# Altium schematic sheet ConectoresEntrada.SchDoc
size 355 x 254 mm; DrawnBy: Constanza Barriga
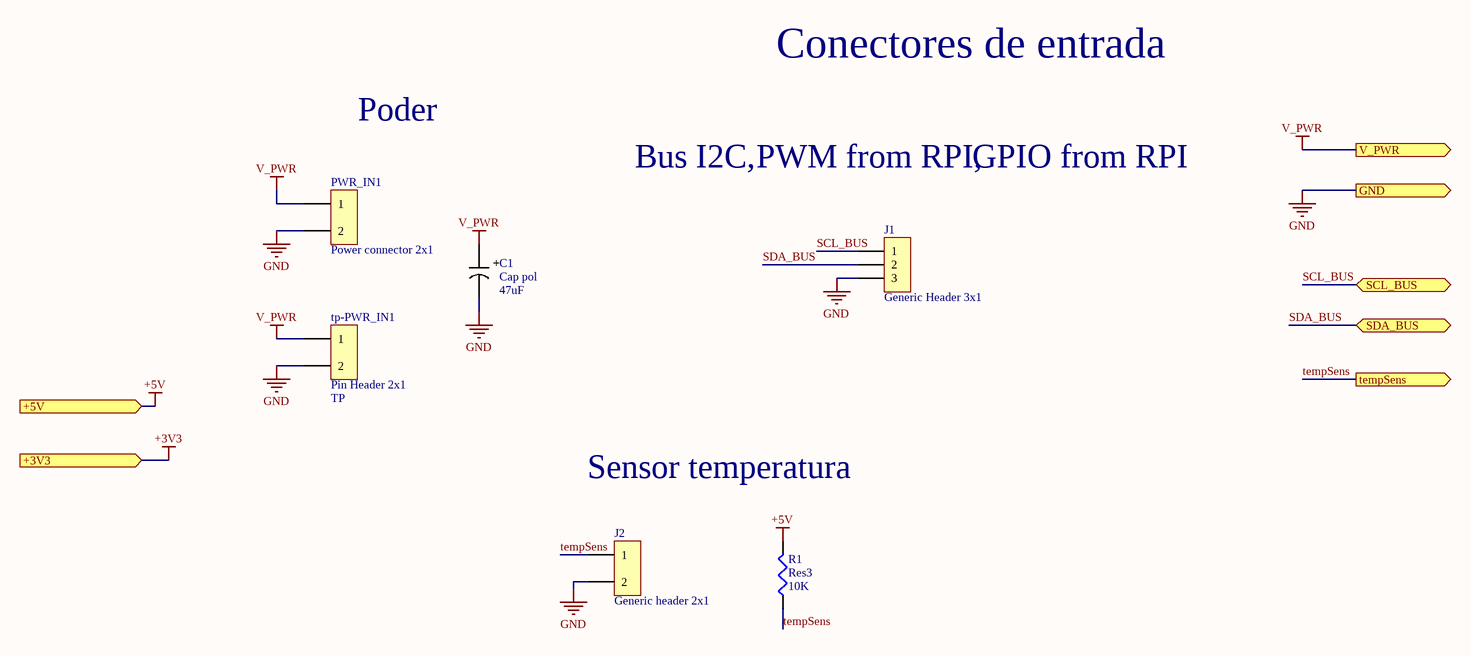
[diagram p0: ConectoresEntrada.SchDoc]

## Parts
C1  Cap pol  value 47uF  [CAP_SMD_Electrolytic_10x10]
J1  Generic Header 3x1  [CONN-TH_A2547WV-3P]
J2  Generic header 2x1  [CONN-TH_A2547WV-2P]
PWR_IN1  Power connector 2x1  [CONN-TH_430450212]
R1  Res3  value 10K  [J1-0603]
tp-PWR_IN1  Pin Header 2x1  [HDR-TH_P2.54-H-M_A2541WV-2P]

## Ports
+3V3 (in), +5V (in), GND (out), SCL_BUS (bidir), SDA_BUS (bidir), tempSens (out), V_PWR (out)

## Nets
+3V3: port +3V3
+5V: R1.2 ; port +5V
GND: C1.1 J1.3 J2.2 PWR_IN1.2 tp-PWR_IN1.2 ; port GND
V_PWR: C1.2 PWR_IN1.1 tp-PWR_IN1.1 ; port V_PWR
SCL_BUS: J1.1 ; port SCL_BUS
SDA_BUS: J1.2 ; port SDA_BUS
tempSens: J2.1 R1.1 ; port tempSens

## Notes on the sheet
- Conectores de entrada
- Poder
- Bus I2C,
- PWM from RPI,
- GPIO from RPI
- (near tp-PWR_IN1) TP
- Sensor temperatura
- (in symbol Cap pol) +

## Library data of the parts
C1 = Cap pol: Electrolytic Aluminium Capacitor; Manufacturer: Lelon; Manufacturer Part Number: VEJ470M1HTR-1010; Voltage: 50V; Supplier 1: LCSC; Supplier Part Number 1: C249662; Package: SMD,10x10mm
J1 = Header - 3x1: Generic Header 3pos, 1 row, 2.54 pitch; Manufacturer: CJT(Changjiang Connectors); Manufacturer Part Number: A2547WV-3P; Pitch: 2.54; Supplier 1: LCSC; Supplier Part Number 1: C239378; Package: Through Hole,P=2.54mm
J2 = Header - 2x1: Generic Header 2pos, 1 row, 2.54 pitch; Manufacturer: CJT(Changjiang Connectors); Manufacturer Part Number: A2547WV-2P; Pitch: 2.54mm; Supplier 1: LCSC; Supplier Part Number 1: C239377; Package: Through Hole,P=2.54mm
PWR_IN1 = PC - 2X1: Generic Header Power 2pos; Manufacturer: MOLEX; Manufacturer Part Number: 430450212; Supplier 1: LCSC; Supplier Part Number 1: C293362; Package: *
R1 = Res3: Resistor; Manufacturer: PANASONIC; Manufacturer Part Number: ERJPA3F1002V; Published: 8-Jun-2000; LatestRevisionDate: 29-May-2009; LatestRevisionNote: IPC-7351 Footprint Added.; PackageReference: J1-0603; Publisher: Altium Limited; PackageDescription: Chip Resistor; Supplier 1: LCSC; Supplier Part Number 1: C441927
tp-PWR_IN1 = Header - 2x1c: Pin Header 2pos, 1 row, 2.54 pitch; Manufacturer: CJT(Changjiang Connectors); Manufacturer Part Number: A2541WV-2P; Pitch: 2.54; Supplier 1: LCSC; Supplier Part Number 1: C225477